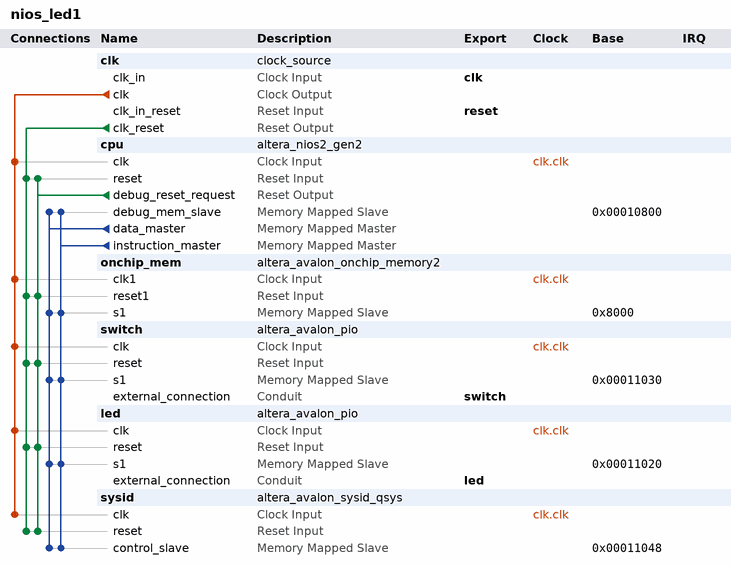
[diagram p0: system contents]
# Platform Designer (Qsys) system nios_led1, Cyclone V 5CSEMA5F31C6
# Parameters at their usual value, and those the tool derives, are not listed.
package require -exact qsys 21.1
create_system nios_led1
set_project_property DEVICE_FAMILY {Cyclone V}
set_project_property DEVICE 5CSEMA5F31C6

add_instance clk clock_source 21.1
set_instance_parameter_value clk clockFrequency 50000000

add_instance cpu altera_nios2_gen2 21.1
set_instance_parameter_value cpu dcache_size 2048
set_instance_parameter_value cpu exceptionSlave onchip_mem.s1
set_instance_parameter_value cpu icache_size 4096
set_instance_parameter_value cpu impl Tiny
set_instance_parameter_value cpu resetSlave onchip_mem.s1

add_instance onchip_mem altera_avalon_onchip_memory2 21.1
set_instance_parameter_value onchip_mem dataWidth 32
set_instance_parameter_value onchip_mem dualPort false
set_instance_parameter_value onchip_mem initMemContent true
set_instance_parameter_value onchip_mem initializationFileName onchip_mem.hex
set_instance_parameter_value onchip_mem memorySize 20480

add_instance switch altera_avalon_pio 21.1
set_instance_parameter_value switch direction Input
set_instance_parameter_value switch width 10

add_instance led altera_avalon_pio 21.1
set_instance_parameter_value led direction Output
set_instance_parameter_value led width 2

add_instance sysid altera_avalon_sysid_qsys 21.1
set_instance_parameter_value sysid id 0

# connections
add_connection clk.clk cpu.clk clock
add_connection clk.clk led.clk clock
add_connection clk.clk onchip_mem.clk1 clock
add_connection clk.clk switch.clk clock
add_connection clk.clk sysid.clk clock
add_connection clk.clk_reset cpu.reset reset
add_connection clk.clk_reset led.reset reset
add_connection clk.clk_reset onchip_mem.reset1 reset
add_connection clk.clk_reset switch.reset reset
add_connection clk.clk_reset sysid.reset reset
add_connection cpu.debug_reset_request cpu.reset reset
add_connection cpu.debug_reset_request led.reset reset
add_connection cpu.debug_reset_request onchip_mem.reset1 reset
add_connection cpu.debug_reset_request switch.reset reset
add_connection cpu.debug_reset_request sysid.reset reset
add_connection cpu.data_master cpu.debug_mem_slave avalon
set_connection_parameter_value cpu.data_master/cpu.debug_mem_slave baseAddress 0x00010800
add_connection cpu.data_master led.s1 avalon
set_connection_parameter_value cpu.data_master/led.s1 baseAddress 0x00011020
add_connection cpu.data_master onchip_mem.s1 avalon
set_connection_parameter_value cpu.data_master/onchip_mem.s1 baseAddress 0x8000
add_connection cpu.data_master switch.s1 avalon
set_connection_parameter_value cpu.data_master/switch.s1 baseAddress 0x00011030
add_connection cpu.data_master sysid.control_slave avalon
set_connection_parameter_value cpu.data_master/sysid.control_slave baseAddress 0x00011048
add_connection cpu.instruction_master cpu.debug_mem_slave avalon
set_connection_parameter_value cpu.instruction_master/cpu.debug_mem_slave baseAddress 0x00010800
add_connection cpu.instruction_master led.s1 avalon
set_connection_parameter_value cpu.instruction_master/led.s1 baseAddress 0x00011020
add_connection cpu.instruction_master onchip_mem.s1 avalon
set_connection_parameter_value cpu.instruction_master/onchip_mem.s1 baseAddress 0x8000
add_connection cpu.instruction_master switch.s1 avalon
set_connection_parameter_value cpu.instruction_master/switch.s1 baseAddress 0x00011030
add_connection cpu.instruction_master sysid.control_slave avalon
set_connection_parameter_value cpu.instruction_master/sysid.control_slave baseAddress 0x00011048

# exported interfaces
add_interface clk clock sink
set_interface_property clk EXPORT_OF clk.clk_in
add_interface led conduit end
set_interface_property led EXPORT_OF led.external_connection
add_interface reset reset sink
set_interface_property reset EXPORT_OF clk.clk_in_reset
add_interface switch conduit end
set_interface_property switch EXPORT_OF switch.external_connection

set_interconnect_requirement {$system} qsys_mm.clockCrossingAdapter HANDSHAKE
set_interconnect_requirement {$system} qsys_mm.enableEccProtection FALSE
set_interconnect_requirement {$system} qsys_mm.insertDefaultSlave FALSE
set_interconnect_requirement {$system} qsys_mm.maxAdditionalLatency 1

save_system nios_led1.qsys
